# EAGLE schematic Master board (EAGLE 9.6.1)
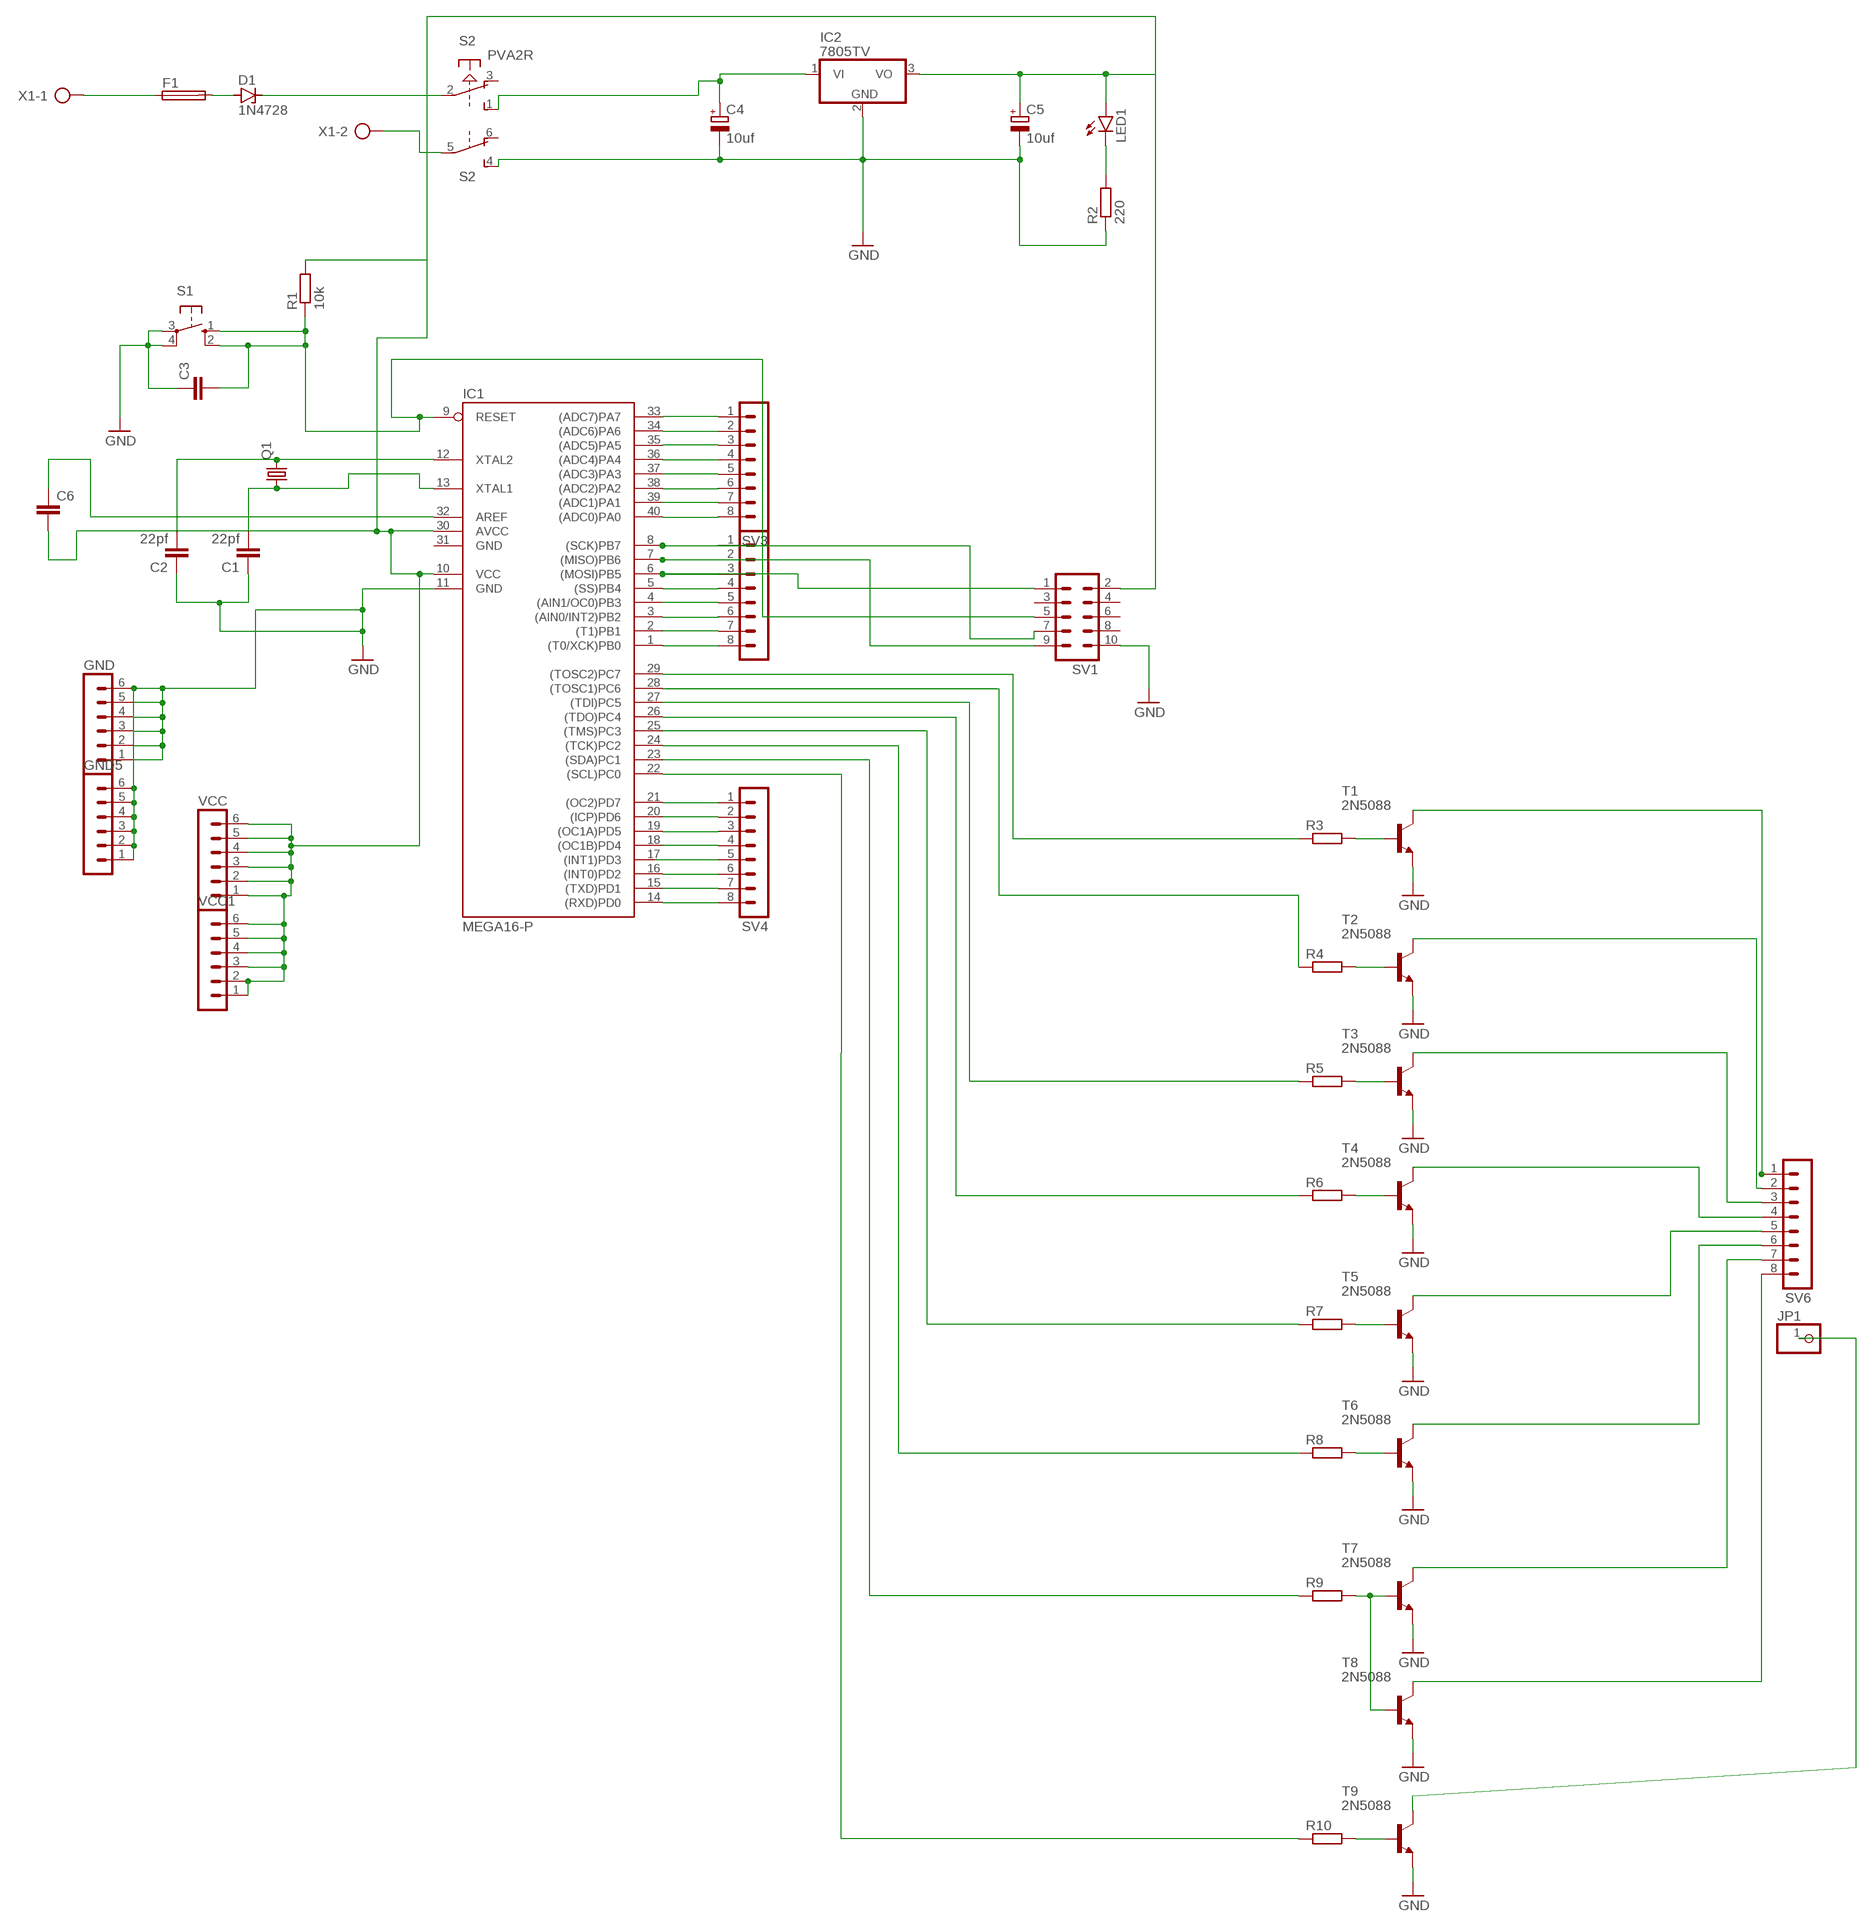
[diagram p0: schematic, sheet 1]

## Parts
C1  22pf  C-EU025-025X050  [C025-025X050]
C2  22pf  C-EU025-025X050  [C025-025X050]
C3  C-EU025-025X050  [C025-025X050]
C4  10uf  CPOL-EUE2.5-6  [E2,5-6]
C5  10uf  CPOL-EUE2.5-6  [E2,5-6]
C6  C-EU025-025X050  [C025-025X050]
D1  1N4728  [DO41Z10]
F1  GSH15  [GSH15]
GND  MA06-1  [MA06-1]
GND5  MA06-1  [MA06-1]
IC1  MEGA16-P  [DIL40]
IC2  7805TV  [TO220V]
JP1  PINHD-1X1  [1X01]
LED1  LED5MM  [LED5MM]
Q1  CRYSTALHC49U70  [HC49U70]
R1  10k  R-EU_0207/10  [0207/10]
R2  220  R-EU_0207/10  [0207/10]
R3  R-EU_0207/10  [0207/10]
R4  R-EU_0207/10  [0207/10]
R5  R-EU_0207/10  [0207/10]
R6  R-EU_0207/10  [0207/10]
R7  R-EU_0207/10  [0207/10]
R8  R-EU_0207/10  [0207/10]
R9  R-EU_0207/10  [0207/10]
R10  R-EU_0207/10  [0207/10]
S1  10-XX  [B3F-10XX]
S2  PVA2R  [PVA2R]
SV1  MA05-2  [MA05-2]
SV3  MA08-1W  [MA08-1W]
SV4  MA08-1W  [MA08-1W]
SV5  MA08-1W  [MA08-1W]
SV6  MA08-1W  [MA08-1W]
T1  2N5088  [TO92]
T2  2N5088  [TO92]
T3  2N5088  [TO92]
T4  2N5088  [TO92]
T5  2N5088  [TO92]
T6  2N5088  [TO92]
T7  2N5088  [TO92]
T8  2N5088  [TO92]
T9  2N5088  [TO92]
VCC  MA06-1  [MA06-1]
VCC1  MA06-1  [MA06-1]
X1  AK500/2  [AK500/2]

## Nets
GND: C1.1 C2.1 C3.1 C4.- C5.- GND5.1 GND5.2 GND5.3 GND5.4 GND5.5 GND5.6 GND.1 GND.2 GND.3 GND.4 GND.5 GND.6 IC1.11(GND) IC2.2(GND) R2.1 S1.3(P) S1.4(P1) S2.4(2:S) SV1.10 T1.3(E) T2.3(E) T3.3(E) T4.3(E) T5.3(E) T6.3(E) T7.3(E) T8.3(E) T9.3(E)
N$1: C1.2 IC1.13(XTAL1) Q1.1
N$2: C2.2 IC1.12(XTAL2) Q1.2
N$3: IC1.8((SCK)PB7) SV1.7 SV5.1
N$6: C4.+ IC2.1(VI) S2.1(1:S)
N$7: IC1.21((OC2)PD7) SV4.1
N$8: C3.2 IC1.9(RESET) R1.1 S1.1(S) S1.2(S1) SV1.5
N$9: LED1.K(C) R2.2
N$10: IC1.33((ADC7)PA7) SV3.1
N$11: IC1.34((ADC6)PA6) SV3.2
N$12: IC1.35((ADC5)PA5) SV3.3
N$13: IC1.36((ADC4)PA4) SV3.4
N$14: IC1.20((ICP)PD6) SV4.2
N$15: D1.A F1.2
N$16: F1.1 X1.1
N$17: D1.C S2.2(1:P)
N$18: IC1.19((OC1A)PD5) SV4.3
N$19: S2.5(2:P) X1.2
N$20: IC1.29((TOSC2)PC7) R3.1
N$21: IC1.28((TOSC1)PC6) R4.1
N$22: IC1.23((SDA)PC1) R9.1
N$23: IC1.27((TDI)PC5) R5.1
N$24: IC1.26((TDO)PC4) R6.1
N$25: IC1.25((TMS)PC3) R7.1
N$26: IC1.22((SCL)PC0) R10.1
N$27: IC1.7((MISO)PB6) SV1.9 SV5.2
N$28: IC1.37((ADC3)PA3) SV3.5
N$29: IC1.38((ADC2)PA2) SV3.6
N$30: IC1.39((ADC1)PA1) SV3.7
N$31: IC1.40((ADC0)PA0) SV3.8
N$32: IC1.18((OC1B)PD4) SV4.4
N$33: C6.1 IC1.32(AREF)
N$34: IC1.17((INT1)PD3) SV4.5
N$35: IC1.16((INT0)PD2) SV4.6
N$36: IC1.15((TXD)PD1) SV4.7
N$37: IC1.14((RXD)PD0) SV4.8
N$38: IC1.5((SS)PB4) SV5.4
N$39: IC1.4((AIN1/OC0)PB3) SV5.5
N$40: IC1.3((AIN0/INT2)PB2) SV5.6
N$41: C5.+ C6.2 IC1.10(VCC) IC1.30(AVCC) IC2.3(VO) LED1.A R1.2 SV1.2 VCC1.1 VCC1.2 VCC1.3 VCC1.4 VCC1.5 VCC1.6 VCC.1 VCC.2 VCC.3 VCC.4 VCC.5 VCC.6
N$42: IC1.2((T1)PB1) SV5.7
N$43: IC1.1((T0/XCK)PB0) SV5.8
N$44: IC1.6((MOSI)PB5) SV1.1 SV5.3
N$45: R4.2 T2.2(B)
N$47: R5.2 T3.2(B)
N$48: R3.2 T1.2(B)
N$50: R6.2 T4.2(B)
N$52: R7.2 T5.2(B)
N$53: IC1.24((TCK)PC2) R8.1
N$54: R8.2 T6.2(B)
N$56: R9.2 T7.2(B) T8.2(B)
N$58: R10.2 T9.2(B)
N$59: SV6.2 T2.1(C)
N$60: SV6.3 T3.1(C)
N$61: SV6.4 T4.1(C)
N$62: SV6.5 T5.1(C)
N$63: SV6.1 T1.1(C)
N$64: SV6.6 T6.1(C)
N$65: SV6.7 T7.1(C)
N$66: SV6.8 T8.1(C)
N$68: JP1.1 T9.1(C)
Unconnected: S2.3(1:O) S2.6(2:O) SV1.3 SV1.4 SV1.6 SV1.8

## Power pins joined to a net without a drawn wire
GND: IC1.31(GND)

## Library data of the parts
C1-C3 C6 = rcl:C-EU: CAPACITOR, European symbol; SPICEPREFIX: C
C4 C5 = rcl:CPOL-EU: POLARIZED CAPACITOR, European symbol; SPICEPREFIX: C
D1 = diode:1N4728: Z DIODE 3.3 V, 1W, 5 percent
F1 = fuse:GSH15: FUSE HOLDER grid 15mm, 19649 Wickmann; MPN: 64900001039; OC_FARNELL: 1271673; OC_NEWARK: 02P0318
GND GND5 VCC VCC1 = con-lstb:MA06-1: PIN HEADER; OC_FARNELL: unknown; OC_NEWARK: unknown
IC1 = atmel:MEGA16-P: MICROCONTROLLER 16 Kbytes FLASH 1 kbytes SRAM 512 bytes EEPROM USART 8-channel 10 bit ADC Source: avr.lbr; MPN: ATMEGA16-16PU; OC_FARNELL: 9171142; OC_NEWARK: 01M6885
IC2 = linear:78*: Positive VOLTAGE REGULATOR Source: http://cache.national.com/ds/LM/LM78L05.pdf http://www.fairchildsemi.com/ds/LM/LM7805.pdf
JP1 = pinhead:PINHD-1X1: PIN HEADER
LED1 = led:LED: LED OSRAM: - CHIPLED LG R971, LG N971, LY N971, LG Q971, LY Q971, LO R971, LY R971 LH N974, LH R974 LS Q976, LO Q976, LY Q976 LO Q996 - Hyper CHIPLED LW Q18S LB Q993, LB Q99A, LB R99A - SideLED LS A670, LO A670, LY A670, LG A670, LP A670 LB A673, LV A673, LT A673, LW A673 LH A674 LY A675 LS A676, LA A676, LO A676, LY A676, LW A676 LS A679, LY A679, LG A679 - Hyper Micro SIDELED® LS Y876, LA Y876, LO Y876, LY Y876 LT Y87S - SmartLED LW L88C, LW L88S LB L89C, LB L89S, LG L890 LS L89K, LO L89K, LY L89K LS L896, LA L896, LO L896, LY L896 - TOPLED LS T670, LO T670, LY T670, LG T670, LP T670 LSG T670, LSP T670, LSY T670, LOP T670, LYG T670 LG T671, LOG T671, LSG T671 LB T673, LV T673, LT T673, LW T673 LH T674 LS T676, LA T676, LO T676, LY T676, LB T676, LH T676, LSB T676, LW T676 LB T67C, LV T67C, LT T67C, LS T67K, LO T67K, LY T67K, LW E67C LS E67B, LA E67B, LO E67B, LY E67B, LB E67C, LV E67C, LT E67C LW T67C LS T679, LY T679, LG T679 LS T770, LO T770, LY T770, LG T770, LP T770 LB T773, LV T773, LT T773, LW T773 LH T774 LS E675, LA E675, LY E675, LS T675 LS T776, LA T776, LO T776, LY T776, LB T776 LHGB T686 LT T68C, LB T68C - Hyper Mini TOPLED® LB M676 - Mini TOPLED Santana® LG M470 LS M47K, LO M47K, LY M47K Source: http://www.osram.convergy.de LUXEON: - LUMILED® LXK2-PW12-R00, LXK2-PW12-S00, LXK2-PW14-U00, LXK2-PW14-V00 LXK2-PM12-R00, LXK2-PM12-S00, LXK2-PM14-U00 LXK2-PE12-Q00, LXK2-PE12-R00, LXK2-PE12-S00, LXK2-PE14-T00, LXK2-PE14-U00 LXK2-PB12-K00, LXK2-PB12-L00, LXK2-PB12-M00, LXK2-PB14-N00, LXK2-PB14-P00, LXK2-PB14-Q00 LXK2-PR12-L00, LXK2-PR12-M00, LXK2-PR14-Q00, LXK2-PR14-R00 LXK2-PD12-Q00, LXK2-PD12-R00, LXK2-PD12-S00 LXK2-PH12-R00, LXK2-PH12-S00 LXK2-PL12-P00, LXK2-PL12-Q00, LXK2-PL12-R00 Source: www.luxeon.com KINGBRIGHT: KA-3528ASYC Source: www.kingbright.com
Q1 = crystal:CRYSTAL: CRYSTAL; OC_FARNELL: unknown; OC_NEWARK: unknown
R1-R10 = rcl:R-EU_: RESISTOR, European symbol; SPICEPREFIX: R
S1 = switch-omron:10-XX: OMRON SWITCH; MPN: B3F-1000; OC_FARNELL: 176432; OC_NEWARK: 36M3542
S2 = switch-misc:PVA2R: ITT SWITCH
SV1 = con-lstb:MA05-2: PIN HEADER; OC_FARNELL: unknown; OC_NEWARK: unknown
SV3-SV6 = con-lstb:MA08-1W: PIN HEADER; OC_FARNELL: unknown; OC_NEWARK: unknown
T1-T9 = transistor-neu-to92:2N5088: NPN TRANSISTOR
X1 = con-ptr500:AK500/2: CONNECTOR; OC_FARNELL: unknown; OC_NEWARK: unknown